# EAGLE design MW-Mega-Shield (EAGLE 9.0.1)
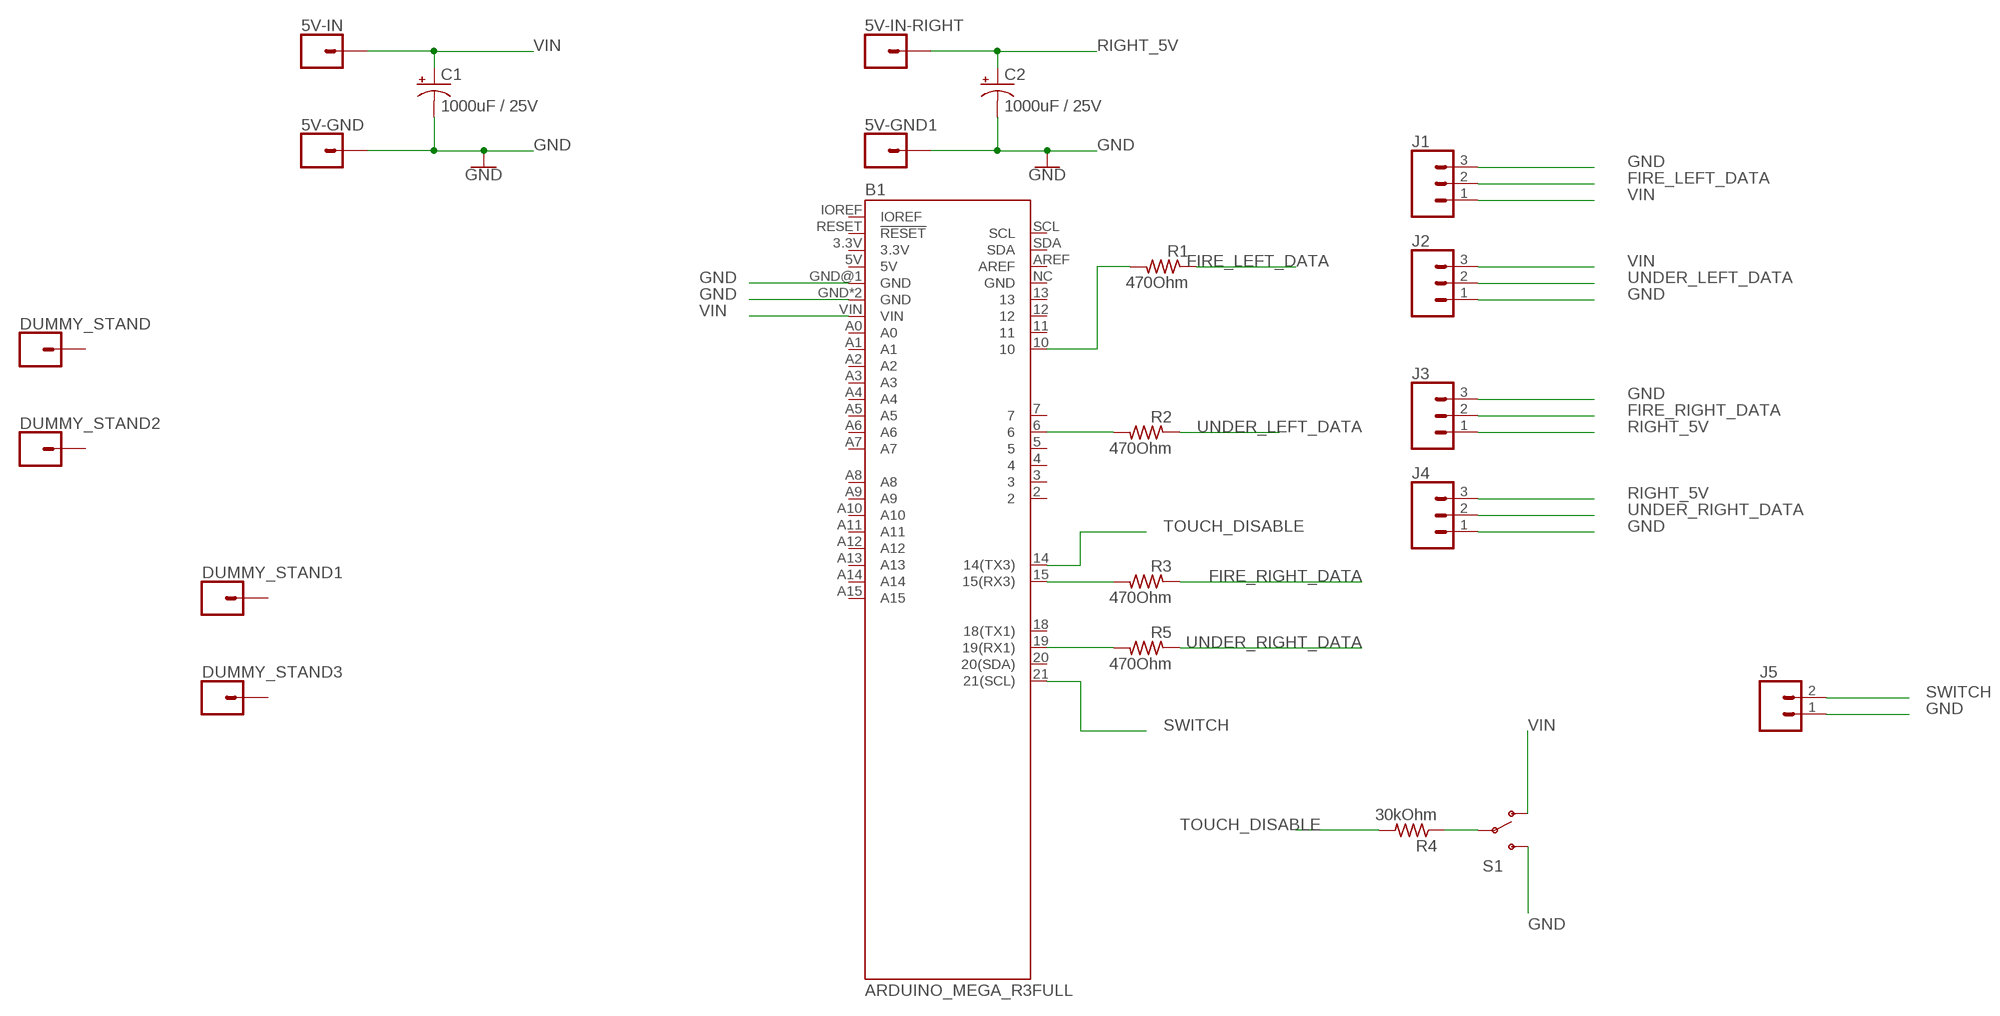
[diagram p0: schematic, sheet 1]

## Parts
5V-GND  CONN_01  [1X01]
5V-GND1  CONN_01  [1X01]
5V-IN  CONN_01  [1X01]
5V-IN-RIGHT  CONN_01  [1X01]
B1  ARDUINO_MEGA_R3FULL  [ARDUINO_MEGA_NO_SILK]
C1  1000uF / 25V  CPOL-USE5-10.5  [E5-10,5]
C2  1000uF / 25V  CPOL-USE5-10.5  [E5-10,5]
DUMMY_STAND  CONN_01  [1X01]
DUMMY_STAND1  CONN_01  [1X01]
DUMMY_STAND2  CONN_01  [1X01]
DUMMY_STAND3  CONN_01  [1X01]
J1  CONN_03SCREW-NS  [SCREWTERMINAL-3.5MM-3-NS]
J2  CONN_03SCREW-NS  [SCREWTERMINAL-3.5MM-3-NS]
J3  CONN_03SCREW-NS  [SCREWTERMINAL-3.5MM-3-NS]
J4  CONN_03SCREW-NS  [SCREWTERMINAL-3.5MM-3-NS]
J5  CONN_02  [1X02]
R1  470Ohm  R-US_R0603  [R0603]
R2  470Ohm  R-US_R0603  [R0603]
R3  470Ohm  R-US_R0603  [R0603]
R4  30kOhm  R-US_R0603  [R0603]
R5  470Ohm  R-US_R0603  [R0603]
S1  SWITCH-SPDTSMD  [SWITCH_SPDT_SMD]

## Nets
FIRE_LEFT_DATA: J1.2 R1.1
FIRE_RIGHT_DATA: J3.2 R3.1
GND: 5V-GND1.1 5V-GND.1 B1.GND B1.GND@1(GND) B1.GND@4(GND) C1.- C2.- J1.3 J2.1 J3.3 J4.1 J5.1 S1.3(S)
N$1: B1.10 R1.2
N$2: B1.6 R2.2
N$3: R4.1 S1.2(P)
N$4: B1.15(15(RX3)) R3.2
N$5: B1.19(19(RX1)) R5.2
RIGHT_5V: 5V-IN-RIGHT.1 C2.+ J3.1 J4.3
SWITCH: B1.21(21(SCL)) J5.2
TOUCH_DISABLE: B1.14(14(TX3)) R4.2
UNDER_LEFT_DATA: J2.2 R2.1
UNDER_RIGHT_DATA: J4.2 R5.1
VIN: 5V-IN.1 B1.VIN C1.+ J1.1 J2.3 S1.1(O)
Unconnected: B1.2 B1.3 B1.3.3V B1.4 B1.5 B1.5V B1.7 B1.11 B1.12 B1.13 B1.18(18(TX1)) B1.20(20(SDA)) B1.A0 B1.A1 B1.A2 B1.A3 B1.A4 B1.A5 B1.A6 B1.A7 B1.A8 B1.A9 B1.A10 B1.A11 B1.A12 B1.A13 B1.A14 B1.A15 B1.AREF B1.IOREF B1.NC(GND) B1.RESET(!RESET) B1.SCL B1.SDA DUMMY_STAND1.1 DUMMY_STAND2.1 DUMMY_STAND3.1 DUMMY_STAND.1

## Library data of the parts
5V-GND 5V-GND1 5V-IN 5V-IN-RIGHT DUMMY_STAND DUMMY_STAND1-DUMMY_STAND3 = SparkFun-Connectors:CONN_01: Single connection point. Often used as Generic Header-pin footprint for 0.1 inch spaced/style header connections On any of the 0.1 inch spaced packages, you can populate with these: Break Away Headers - Straight <https://www.sparkfun.com/products/116> (PRT-00116) Break Away Male Headers - Right Angle <https://www.sparkfun.com/products/553> (PRT-00553) Female Headers <https://www.sparkfun.com/products/115> (PRT-00115) Break Away Headers - Machine Pin <https://www.sparkfun.com/products/117> (PRT-00117) Break Away Female Headers - Swiss Machine Pin <https://www.sparkfun.com/products/743> (PRT-00743) This device is also useful as a general connection point to wire up your design to another part of your project. Our various solder wires solder well into these plated through hole pads. Hook-Up Wire - Assortment (Stranded, 22 AWG) <https://www.sparkfun.com/products/11375> (PRT-11375) Hook-Up Wire - Assortment (Solid Core, 22 AWG) <https://www.sparkfun.com/products/11367> (PRT-11367) View the entire wire category on our website here <https://www.sparkfun.com/categories/141> Special notes: SMTSO-256-ET is a "flush mount" nut for a 4-40 screw. We mostly use this on specialty testbeds; it is a nice way to connect hardware to your PCB at an adjustable hieght. Also note, the SNAP packages are for using a snappable style connector. We sell a baggie of snaps and they are also used on two LilyPad designs: Snap Assortment - 30 pack (male and female) <https://www.sparkfun.com/products/11347> (DEV-11347) LilyPad Arduino SimpleSnap <https://www.sparkfun.com/products/10941> (DEV-10941) LilyPad SimpleSnap Protoboard <https://www.sparkfun.com/products/10940> (DEV-10940)
B1 = SparkFun-Boards:ARDUINO_MEGA_R3: Arduino Mega R3 ATmega2560 R3 compatible footprint. SparkFun Products: Arduino Mega 2560 R3 <https://www.sparkfun.com/products/11061>
C1 C2 = rcl:CPOL-US: POLARIZED CAPACITOR, American symbol; SPICEPREFIX: C
J1-J4 = SparkFun-Connectors:CONN_03: Multi connection point. Often used as Generic Header-pin footprint for 0.1 inch spaced/style header connections On any of the 0.1 inch spaced packages, you can populate with these: Break Away Headers - Straight <https://www.sparkfun.com/products/116> (PRT-00116) Break Away Male Headers - Right Angle <https://www.sparkfun.com/products/553> (PRT-00553) Female Headers <https://www.sparkfun.com/products/115> (PRT-00115) Break Away Headers - Machine Pin <https://www.sparkfun.com/products/117> (PRT-00117) Break Away Female Headers - Swiss Machine Pin <https://www.sparkfun.com/products/743> (PRT-00743) Stackable Header - 3 Pin (Female, 0.1") <https://www.sparkfun.com/products/13875> (PRT-13875) For SCREWTERMINALS and SPRING TERMINALS visit here: Screw Terimnals on SparkFun.com <https://www.sparkfun.com/search/results?term=Screw+Terminals> (5mm/3.5mm/2.54mm spacing) This device is also useful as a general connection point to wire up your design to another part of your project. Our various solder wires solder well into these plated through hole pads. Hook-Up Wire - Assortment (Stranded, 22 AWG) <https://www.sparkfun.com/products/11375> (PRT-11375) Hook-Up Wire - Assortment (Solid Core, 22 AWG) <https://www.sparkfun.com/products/11367> (PRT-11367) View the entire wire category on our website here <https://www.sparkfun.com/categories/141> Special notes: Molex polarized connector foot print use with SKU : PRT-08232 with associated crimp pins and housings.
J5 = SparkFun-Connectors:CONN_02: Multi connection point. Often used as Generic Header-pin footprint for 0.1 inch spaced/style header connections On any of the 0.1 inch spaced packages, you can populate with these: Break Away Headers - Straight <https://www.sparkfun.com/products/116> (PRT-00116) Break Away Male Headers - Right Angle <https://www.sparkfun.com/products/553> (PRT-00553) Female Headers <https://www.sparkfun.com/products/115> (PRT-00115) Break Away Headers - Machine Pin <https://www.sparkfun.com/products/117> (PRT-00117) Break Away Female Headers - Swiss Machine Pin <https://www.sparkfun.com/products/743> (PRT-00743) For SCREWTERMINALS and SPRING TERMINALS visit here: Screw Terimnals on SparkFun.com <https://www.sparkfun.com/search/results?term=Screw+Terminals> (5mm/3.5mm/2.54mm spacing) This device is also useful as a general connection point to wire up your design to another part of your project. Our various solder wires solder well into these plated through hole pads. Hook-Up Wire - Assortment (Stranded, 22 AWG) <https://www.sparkfun.com/products/11375> (PRT-11375) Hook-Up Wire - Assortment (Solid Core, 22 AWG) <https://www.sparkfun.com/products/11367> (PRT-11367) View the entire wire category on our website here <https://www.sparkfun.com/categories/141> Special notes: Molex polarized connector foot print use with: PRT-08233 with associated crimp pins and housings. 2.54_SCREWTERM for use with PRT-10571. 3.5mm Screw Terminal footprints for PRT-08084 5mm Screw Terminal footprints for use with PRT-08432
R1-R5 = rcl:R-US_: RESISTOR, American symbol; SPICEPREFIX: R
S1 = SparkFun-Retired:SWITCH-SPDT: SPDT Switch Simple slide switch, Spark Fun Electronics SKU : COM-00102 DPDT SMT slide switch, AYZ0202, SWCH-08179

## Board
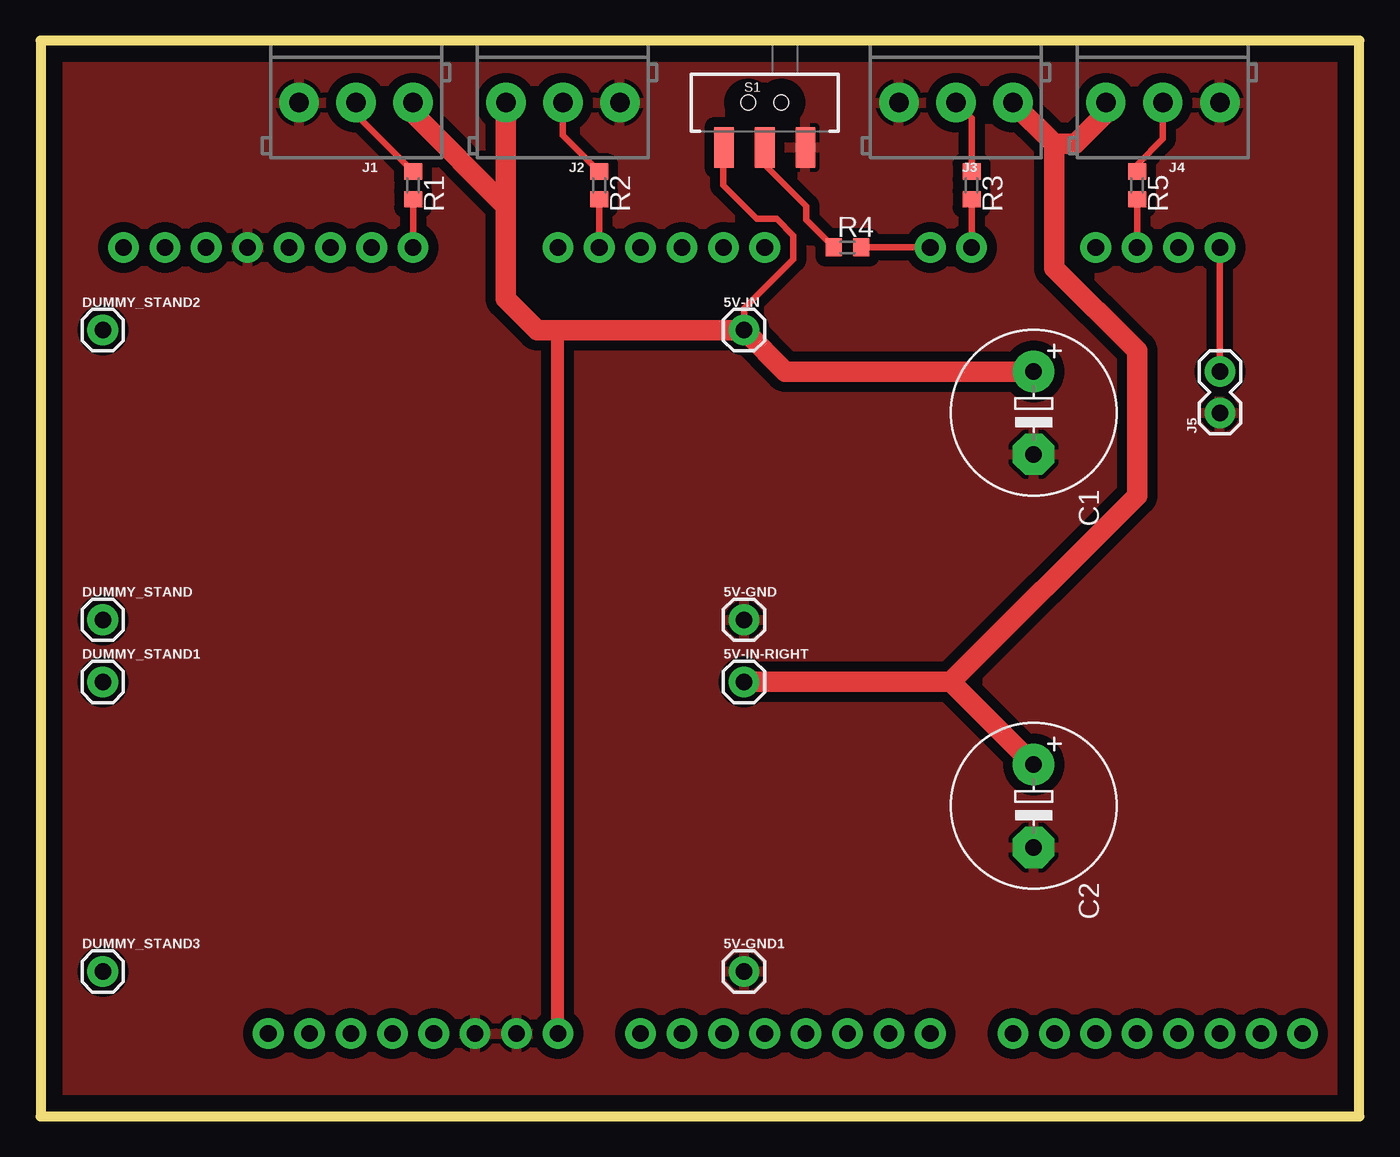
[diagram p1: board, top side]

Size 80.95 x 66.03 mm. Coordinates in mm from the lower left corner, seen from the top.
Outline: 0,0 80.95,0 80.95,66.03 0,66.03 0,0
Copper layers (1*16): Top 0.035mm / dielectric 1.5mm / Bottom 0.035mm
Design rules "default *": minimum track width 0.4mm, minimum drill 0.35mm, track to track 24mil, track to pad 24mil, pad to pad 24mil, via to via 24mil, smd to smd 24mil, copper to edge 40mil, drill to drill 6mil, minimum pad ring 10mil, minimum via ring 8mil, stop-mask expansion 4mil, vias tented up to drill 0mil, thermal gap 10mil

### Footprints (pad centres in the part's own frame; a part is rotated, then mirrored left to right if it is on the bottom)
1X01 = drill 1.016 pad 1.88: 1 0,0
ARDUINO_MEGA_NO_SILK = drill 1.016 pad 1.88: 2 8.89,24.13; 3 6.35,24.13; 3.3V -13.97,-24.13; 4 3.81,24.13; 5 1.27,24.13; 5V -11.43,-24.13; 6 -1.27,24.13; 7 -3.81,24.13; 10 -12.7,24.13; 11 -15.24,24.13; 12 -17.78,24.13; 13 -20.32,24.13; 14 19.05,24.13; 15 21.59,24.13; 18 29.21,24.13; 19 31.75,24.13; 20 34.29,24.13; 21 36.83,24.13; A0 1.27,-24.13; A1 3.81,-24.13; A2 6.35,-24.13; A3 8.89,-24.13; A4 11.43,-24.13; A5 13.97,-24.13; A6 16.51,-24.13; A7 19.05,-24.13; A8 24.13,-24.13; A9 26.67,-24.13; A10 29.21,-24.13; A11 31.75,-24.13; A12 34.29,-24.13; A13 36.83,-24.13; A14 39.37,-24.13; A15 41.91,-24.13; AREF -25.4,24.13; GND -8.89,-24.13; GND@1 -6.35,-24.13; GND@4 -22.86,24.13; IOREF -19.05,-24.13; NC -21.59,-24.13; RESET -16.51,-24.13; SCL -30.48,24.13; SDA -27.94,24.13; VIN -3.81,-24.13
E5-10,5 = drill 1.016 pad 2.54: + -2.54,0 | drill 1.016 pad 2.54 octagon: - 2.54,0
SCREWTERMINAL-3.5MM-3-NS = drill 1.2 pad 2.413: 1 0,0; 2 3.5,0; 3 7,0
1X02 = drill 1.016 pad 1.88: 1 0,0; 2 2.54,0
R0603 = smd 1 x 1.1: 1 -0.85,0; 2 0.85,0
SWITCH_SPDT_SMD = smd 1.2 x 2.5: 1 -2.5,-2.75; 2 0,-2.75; 3 2.5,-2.75 | hole 0.9: -1.01,0; 1.01,0

### Placement (x,y rotation side)
5V-GND  43.18,30.48 0 top
5V-GND1  43.18,8.89 0 top
5V-IN  43.18,48.26 0 top
5V-IN-RIGHT  43.18,26.67 0 top
B1  35.56,29.21 0 top
C1  60.96,43.18 270 top
C2  60.96,19.05 270 top
DUMMY_STAND  3.81,30.48 0 top
DUMMY_STAND1  3.81,26.67 0 top
DUMMY_STAND2  3.81,48.26 0 top
DUMMY_STAND3  3.81,8.89 0 top
J1  22.86,62.23 180 top
J2  35.56,62.23 180 top
J3  59.69,62.23 180 top
J4  72.39,62.23 180 top
J5  72.39,43.18 90 top
R1  22.86,57.15 270 top
R2  34.29,57.15 270 top
R3  57.15,57.15 270 top
R4  49.53,53.34 0 top
R5  67.31,57.15 270 top
S1  44.45,62.23 0 top

### Tracks (layer width: path | path; a pad name or v marks a point on that pad's centre or on a via)
FIRE_LEFT_DATA
  Top 0.406: R1.1 19.36,61.5 J1.2
FIRE_RIGHT_DATA
  Top 0.406: R3.1 57.15,61.27 J3.2
GND
  pour Top: 0,66.04 81.28,66.04 81.28,0 0,0
N$1
  Top 0.406: R1.2 B1.10
N$2
  Top 0.406: R2.2 B1.6
N$3
  Top 0.406: R4.1 46.99,55.03 46.99,55.88 44.45,58.42 S1.2
N$4
  Top 0.406: B1.15 R3.2
N$5
  Top 0.406: R5.2 B1.19
RIGHT_5V
  Top 1.27: 5V-IN-RIGHT.1 55.88,26.67 | 55.88,26.67 C2.+ | 55.88,26.67 67.31,38.1 67.31,46.99 62.23,52.07 62.23,59.69 | 62.23,59.69 J3.1 | 62.23,59.69 63.5,59.69 65.39,61.58 J4.3
SWITCH
  Top 0.406: B1.21 J5.2
TOUCH_DISABLE
  Top 0.406: R4.2 B1.14
UNDER_LEFT_DATA
  Top 0.406: R2.1 32.06,60.23 J2.2
UNDER_RIGHT_DATA
  Top 0.406: R5.1 67.31,58.42 68.89,60 J4.2
VIN
  Top 0.406: 5V-IN.1 43.18,49.59 46.2,52.61 46.2,54.07 45.18,55.09 43.97,55.09 41.91,57.15 41.91,59.44 S1.1
  Top 0.813: B1.VIN 31.75,48.26
  Top 1.27: C1.+ 45.72,45.72 5V-IN.1 31.75,48.26 30.48,48.26 28.56,50.18 28.56,55.88 | 28.56,55.88 J2.3 | 28.56,55.88 22.86,61.58 J1.1